# Altium schematic sheet Controller.SchDoc: Title
size A3; Date: not used; ApprovedBy: not used; CheckedBy: not used; Author: not used; CompanyName: not used; DrawnBy: Drawn by; Engineer: not used; Organization: SMS-Lab; Address1: not used; Address2: not used; Address3: not used; Address4: not used; DocumentNumber: SMS-yyyy.m; Revision: 0; Time: not used; ModifiedDate: not used; ImagePath: not used
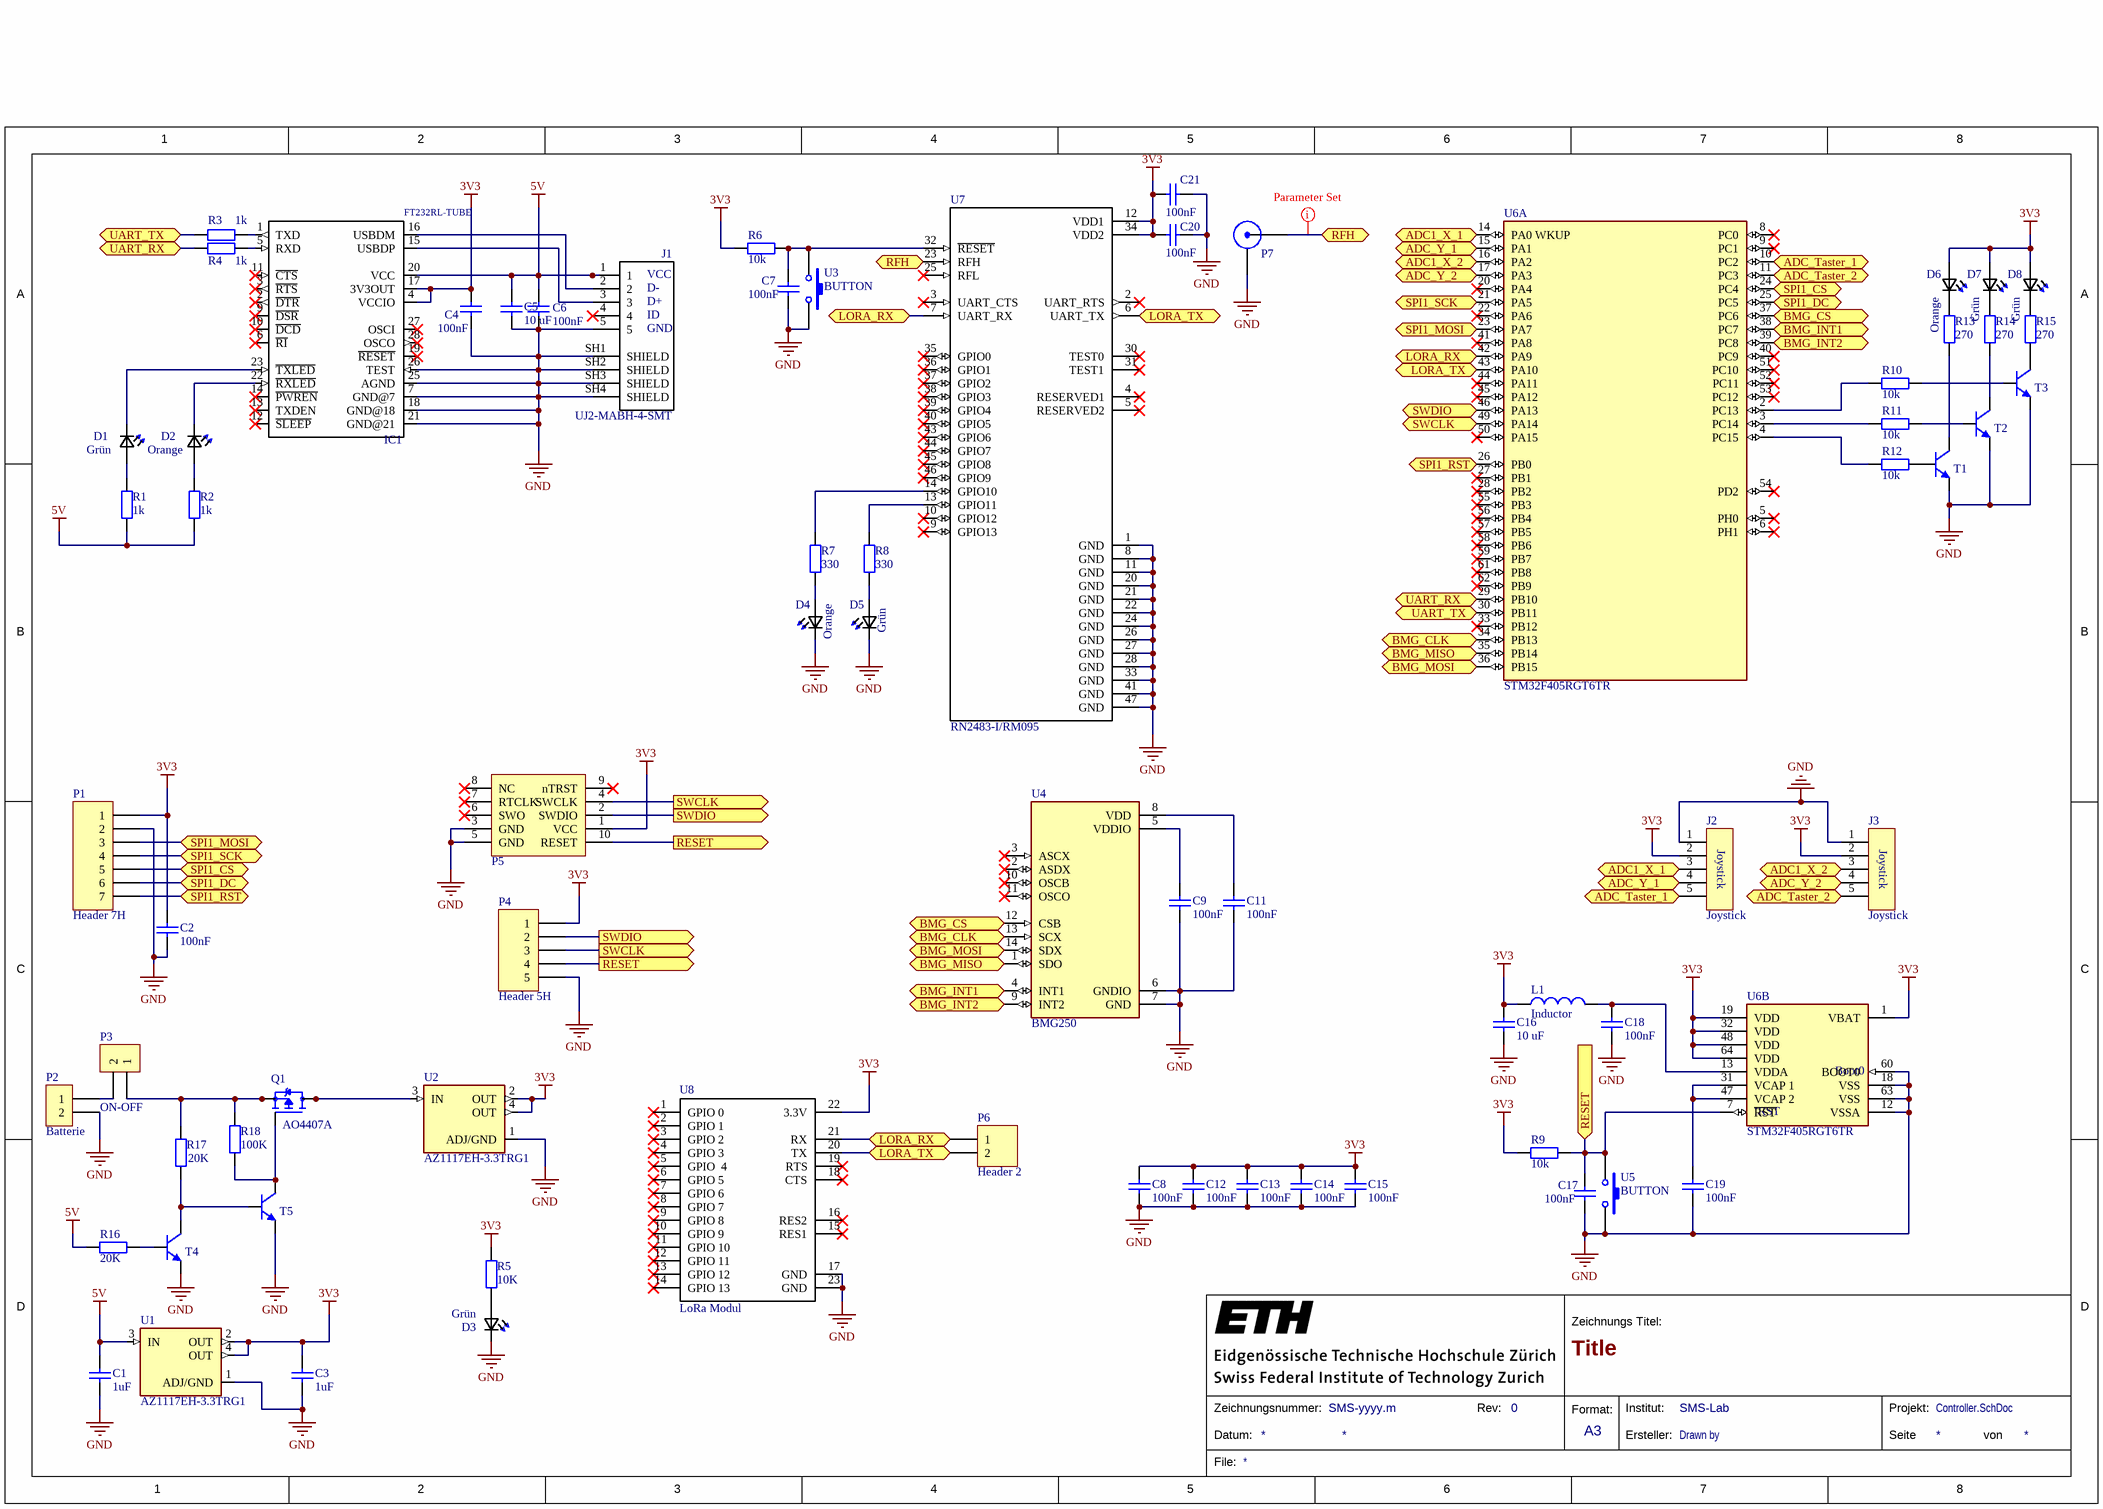
[diagram p0: Controller.SchDoc]

## Parts
C1  1uF  [CAP_0603i_1608m -N]
C2  100nF  [CAP_0402i_1005m -N]
C3  1uF  [CAP_0603i_1608m -N]
C4  100nF  [CAP_0402i_1005m -N]
C5  10 uF  [CAP_0603i_1608m -N]
C6  100nF  [CAP_0402i_1005m -N]
C7  100nF  [CAP_0402i_1005m -N]
C8  100nF  [CAP_0402i_1005m -N]
C9  100nF  [CAP_0402i_1005m -N]
C11  100nF  [CAP_0402i_1005m -N]
C12  100nF  [CAP_0402i_1005m -N]
C13  100nF  [CAP_0402i_1005m -N]
C14  100nF  [CAP_0402i_1005m -N]
C15  100nF  [CAP_0402i_1005m -N]
C16  10 uF  [CAP_0603i_1608m -N]
C17  100nF  [CAP_0402i_1005m -N]
C18  100nF  [CAP_0402i_1005m -N]
C19  100nF  [CAP_0402i_1005m -N]
C20  100nF  [CAP_0402i_1005m -N]
C21  100nF  [CAP_0402i_1005m -N]
D1  Grün  [*0603]
D2  Orange  [*0603]
D3  Grün  [*0603]
D4  Orange  [*0603]
D5  Grün  [*0603]
D6  Orange  [*0603]
D7  Grün  [*0603]
D8  Grün  [*0603]
IC1  FT232RL-TUBE  [*SSOP28-LD]  (value not drawn)
J1  UJ2-MABH-4-SMT  [*CUI_UJ2-MABH-4-SMT_UJ2-MABH-4-SMT(Primary)]
J2  Joystick  [Joystick]
J3  Joystick  [Joystick]
L1  Inductor  [IND_0805I_2013-L]
P1  Header 7H  [HDR1X7H]
P2  Batterie  [MotConnector]
P3  ON-OFF  [MotConnector]
P4  Header 5H  [HDR1X5H]
P5  Tag-Connect TC2050-IDC-NL-No pin assigned  [TAG-CONNECT TC2050-IDC-NL 10-Pin]  (value not drawn)
P6  Header 2  [HDR1X2]
P7  Hirose U.FL-R-SMT-1(10)  [Hirsoe U.FL-R-SMT-1(10)]  (value not drawn)
Q1  AO4407A  [SOIC127P600X175-8N]
R1  1k  [RES_0402i_1005m -N]
R2  1k  [RES_0402i_1005m -N]
R3  1k  [RES_0402i_1005m -N]
R4  1k  [RES_0402i_1005m -N]
R5  10K  [RES_0402i_1005m -N]
R6  10k  [RES_0402i_1005m -N]
R7  330  [RES_0402i_1005m -N]
R8  330  [RES_0402i_1005m -N]
R9  10k  [RES_0402i_1005m -N]
R10  10k  [RES_0402i_1005m -N]
R11  10k  [RES_0402i_1005m -N]
R12  10k  [RES_0402i_1005m -N]
R13  270  [RES_0603i_1608m -N]
R14  270  [RES_0603i_1608m -N]
R15  270  [RES_0603i_1608m -N]
R16  20K  [RES_0402i_1005m -N]
R17  20K  [RES_0402i_1005m -N]
R18  100K  [RES_0402i_1005m -N]
T1  Part Number: MMBT3904-7-F  [SOT-23-M]  (value not drawn)
T2  Part Number: MMBT3904-7-F  [SOT-23-M]  (value not drawn)
T3  Part Number: MMBT3904-7-F  [SOT-23-M]  (value not drawn)
T4  Part Number: MMBT3904-7-F  [SOT-23-M]  (value not drawn)
T5  Part Number: MMBT3904-7-F  [SOT-23-M]  (value not drawn)
U1  AZ1117EH-3.3TRG1  [SOT230P700X180-4N]
U2  AZ1117EH-3.3TRG1  [SOT230P700X180-4N]
U3  BUTTON  [RND 210-00206]
U4  BMG250  [XDCR_BMG250]
U5  BUTTON  [RND 210-00206]
U6  STM32F405RGT6TR  [FP-LQFP64-5W-MFG]  (parts A,B of 2)
U7  RN2483-I/RM095  [*MICROCHIP_RN2483-I/RM095]
U8  LoRa Modul  [LoRA - w/o holes]

## Ports
ADC1_X_1 (bidir), ADC1_X_2 (bidir), ADC_Taster_1 (bidir), ADC_Taster_2 (bidir), ADC_Y_1 (bidir), ADC_Y_2 (bidir), BMG_CLK (bidir), BMG_CS (bidir), BMG_INT1 (bidir), BMG_INT2 (bidir), BMG_MISO (bidir), BMG_MOSI (bidir), LORA_RX (bidir), LORA_TX (bidir), RESET (in), RESET (out), RFH (bidir), SPI1_CS (bidir), SPI1_DC (bidir), SPI1_MOSI (bidir), SPI1_RST (bidir), SPI1_SCK (bidir), SWCLK (bidir), SWCLK (out), SWDIO (bidir), SWDIO (out), UART_RX (bidir), UART_TX (bidir)

## Nets
3V3: C2.1 C3.2 C4.2 C8.2 C12.2 C13.2 C14.2 C15.2 C16.2 C20.2 C21.2 D6.2(A2) D7.2(A2) D8.2(A2) IC1.4(VCCIO) IC1.17(3V3OUT) J2.2 J3.2 L1.2 P1.1 P4.1 P5.1(VCC) R5.2 R6.1 R9.1 U1.2(OUT) U1.4(OUT) U2.2(OUT) U2.4(OUT) U6.1(VBAT) U6.19(VDD) U6.32(VDD) U6.48(VDD) U6.64(VDD) U7.12(VDD1) U7.34(VDD2) U8.22(3.3V)
5V: C1.2 C5.2 C6.2 IC1.20(VCC) J1.1 R1.1 R2.1 R16.2 U1.3(IN)
GND: C1.1 C2.2 C3.1 C4.1 C5.1 C6.1 C7.1 C8.1 C9.1 C11.1 C12.1 C13.1 C14.1 C15.1 C16.1 C17.1 C18.1 C19.2 C20.1 C21.1 D3.1(K2) D4.1(K2) D5.1(K2) IC1.7(GND@7) IC1.18(GND@18) IC1.21(GND@21) IC1.25(AGND) IC1.26(TEST) J1.5 J1.SH1(SHIELD) J1.SH2(SHIELD) J1.SH3(SHIELD) J1.SH4(SHIELD) J2.1 J3.1 P1.2 P2.2 P4.5 P5.3(GND) P5.5(GND) P7.2 T1.2(E) T2.2(E) T3.2(E) T4.2(E) T5.2(E) U1.1(ADJ/GND) U2.1(ADJ/GND) U3.1 U4.6(GNDIO) U4.7(GND) U5.1 U6.12(VSSA) U6.18(VSS) U6.60(BOOT0) U6.63(VSS) U7.1(GND) U7.8(GND) U7.11(GND) U7.20(GND) U7.21(GND) U7.22(GND) U7.24(GND) U7.26(GND) U7.27(GND) U7.28(GND) U7.33(GND) U7.41(GND) U7.47(GND) U8.17(GND) U8.23(GND)
ADC1_X_1: J2.3 U6.14(PA0_WKUP) ; port ADC1_X_1
ADC1_X_2: J3.3 U6.16(PA2) ; port ADC1_X_2
ADC_Taster_1: J2.5 U6.10(PC2) ; port ADC_Taster_1
ADC_Taster_2: J3.5 U6.11(PC3) ; port ADC_Taster_2
ADC_Y_1: J2.4 U6.15(PA1) ; port ADC_Y_1
ADC_Y_2: J3.4 U6.17(PA3) ; port ADC_Y_2
BMG_CLK: U4.13(SCX) U6.34(PB13) ; port BMG_CLK
BMG_CS: U4.12(CSB) U6.37(PC6) ; port BMG_CS
BMG_INT1: U4.4(INT1) U6.38(PC7) ; port BMG_INT1
BMG_INT2: U4.9(INT2) U6.39(PC8) ; port BMG_INT2
BMG_MISO: U4.1(SDO) U6.35(PB14) ; port BMG_MISO
BMG_MOSI: U4.14(SDX) U6.36(PB15) ; port BMG_MOSI
LORA_RX: P6.1 U6.42(PA9) U7.7(UART_RX) U8.21(RX) ; port LORA_RX
LORA_TX: P6.2 U6.43(PA10) U7.6(UART_TX) U8.20(TX) ; port LORA_TX
RESET: C17.2 P4.4 P5.10(RESET) R9.2 U5.2 U6.7(~{RST}) ; port RESET
RFH: P7.1 U7.23(RFH) ; port RFH
SPI1_CS: P1.5 U6.24(PC4) ; port SPI1_CS
SPI1_DC: P1.6 U6.25(PC5) ; port SPI1_DC
SPI1_MOSI: P1.3 U6.23(PA7) ; port SPI1_MOSI
SPI1_RST: P1.7 U6.26(PB0) ; port SPI1_RST
SPI1_SCK: P1.4 U6.21(PA5) ; port SPI1_SCK
SWCLK: P4.3 P5.4(SWCLK) U6.49(PA14) ; port SWCLK
SWDIO: P4.2 P5.2(SWDIO) U6.46(PA13) ; port SWDIO
UART_RX: R4.2 U6.29(PB10) ; port UART_RX
UART_TX: R3.2 U6.30(PB11) ; port UART_TX
NetC7_2: C7.2 R6.2 U3.2 U7.32(~{RESET})
NetC9_2: C9.2 U4.5(VDDIO)
NetC11_2: C11.2 U4.8(VDD)
NetC18_2: C18.2 L1.1 U6.13(VDDA)
NetC19_1: C19.1 U6.31(VCAP_1) U6.47(VCAP_2)
NetD1_1: D1.1(K2) IC1.23(~{TXLED})
NetD1_2: D1.2(A2) R1.2
NetD2_1: D2.1(K2) IC1.22(~{RXLED})
NetD2_2: D2.2(A2) R2.2
NetD3_2: D3.2(A2) R5.1
NetD4_2: D4.2(A2) R7.1
NetD5_2: D5.2(A2) R8.1
NetD6_1: D6.1(K2) R13.2
NetD7_1: D7.1(K2) R14.1
NetD8_1: D8.1(K2) R15.2
NetIC1_1: IC1.1(TXD) R3.1
NetIC1_5: IC1.5(RXD) R4.1
NetIC1_15: IC1.15(USBDP) J1.3
NetIC1_16: IC1.16(USBDM) J1.2
NetP2_1: P2.1 P3.2
NetP3_1: P3.1 Q1.1(S) Q1.2(S) Q1.3(S) R17.2 R18.2
NetQ1_4: Q1.4(G) R18.1 T5.3(C)
NetQ1_5: Q1.5(D) Q1.6(D) Q1.7(D) Q1.8(D) U2.3(IN)
NetR7_2: R7.2 U7.14(GPIO10)
NetR8_2: R8.2 U7.13(GPIO11)
NetR10_1: R10.1 U6.2(PC13)
NetR10_2: R10.2 T3.1(B)
NetR11_1: R11.1 U6.3(PC14)
NetR11_2: R11.2 T2.1(B)
NetR12_1: R12.1 U6.4(PC15)
NetR12_2: R12.2 T1.1(B)
NetR13_1: R13.1 T1.3(C)
NetR14_2: R14.2 T2.3(C)
NetR15_1: R15.1 T3.3(C)
NetR16_1: R16.1 T4.1(B)
NetR17_1: R17.1 T4.3(C) T5.1(B)

Not connected (* = marked no-connect by the designer): IC1 2(~{DTR})* 3(~{RTS})* 6(~{RI})* 9(~{DSR})* 10(~{DCD})* 11(~{CTS})* 12(~{SLEEP})* 13(TXDEN)* 14(~{PWREN})* 19(~{RESET})* 27(OSCI)* 28(OSCO)*; J1 4*; P5 6(SWO)* 7(RTCLK)* 8(NC)* 9(nTRST)*; U4 2(ASDX)* 3(ASCX)* 10(OSCB)* 11(OSCO)*; U6 5(PH0)* 6(PH1)* 8(PC0)* 9(PC1)* 20(PA4)* 22(PA6)* 27(PB1)* 28(PB2)* 33(PB12)* 40(PC9)* 41(PA8)* 44(PA11)* 45(PA12)* 50(PA15)* 51(PC10)* 52(PC11)* 53(PC12)* 54(PD2)* 55(PB3)* 56(PB4)* 57(PB5)* 58(PB6)* 59(PB7)* 61(PB8)* 62(PB9)*; U7 2(UART_RTS)* 3(UART_CTS)* 4(RESERVED1)* 5(RESERVED2)* 9(GPIO13)* 10(GPIO12)* 25(RFL)* 30(TEST0)* 31(TEST1)* 35(GPIO0)* 36(GPIO1)* 37(GPIO2)* 38(GPIO3)* 39(GPIO4)* 40(GPIO5)* 43(GPIO6)* 44(GPIO7)* 45(GPIO8)* 46(GPIO9)*; U8 1(GPIO_0)* 2(GPIO_1)* 3(GPIO_2)* 4(GPIO_3)* 5(GPIO__4)* 6(GPIO_5)* 7(GPIO_6)* 8(GPIO_7)* 9(GPIO_8)* 10(GPIO_9)* 11(GPIO_10)* 12(GPIO_11)* 13(GPIO_12)* 14(GPIO_13)* 15(RES1)* 16(RES2)* 18(CTS)* 19(RTS)*

## Layout directives
rule Impedance Constraint [Min = 50.00    Max = 50.00    ]: RFH

## Notes on the sheet
- (near J1) VCC
- (near J1) D-
- (near J1) D+
- (near J1) ID
- (near J1) GND
- (near U6) TX
- (near U6) RX
- (near U6) !RST
- (near U6) Boot0
- 1
- 2
- 3
- 4
- 5
- 6
- 7
- 8
- A
- B
- C
- D
- Zeichnungs Titel:
- Datum:
- Zeichnungsnummer:
- Rev:
- Format:
- A3
- Ersteller:
- Institut:
- Seite
- Projekt:
- von
- File:

## Library data of the parts
C1-C9 C11-C21 = Cap: capacitor
D1 D3 D5-D8 = LTST-C191KGKT: / LED; SMD; 0603; grün; 35mcd; 1.6x0.8x0.55mm; 130Â°; 2Ã·2.V; 20mA /; MF: Lite-On Inc.; Digi-Key_Purchase_URL: https://www.digikey.ch/product-detail/de/lite-on-inc/LTST-C191KGKT/160-1446-1-ND/386834; SnapEDA_Link: https://www.snapeda.com/parts/LTST-C191KFKT/Lite-On%20Inc./view-part/?ref=snap; MP: LTST-C191KGKT; Digi-Key_Part_Number: 160-1446-1-ND; Package: 0603 Lite-On; Value: *
D2 D4 = LTST-C191KFKT: / LED; SMD; 0603; orange; 45-90mcd; 1.6x0.8x0.55mm; 130Â°; 2Ã·2.4V; 20mA /; MF: Lite-On Inc.; Digi-Key_Purchase_URL: https://www.digikey.com/product-detail/en/lite-on-inc/LTST-C191KFKT/160-1445-1-ND/386832?utm_source=snapeda&utm_medium=aggregator&utm_campaign=symbol; SnapEDA_Link: https://www.snapeda.com/parts/LTST-C191KFKT/Lite-On%20Inc./view-part/?ref=snap; MP: LTST-C191KFKT; Digi-Key_Part_Number: 160-1445-1-ND; Package: 0603 Lite-On; Value: *
IC1 = FT232RL-TUBE: USB-to-UART 1-CH 256byte FIFO 5V 28-Pin SSOP Tube; MF: FTDI,; Digi-Key_Part_Number: 768-1306-ND; Package: SSOP-28 FTDI; Digi-Key_Purchase_URL: https://www.digikey.com/product-detail/en/ftdi-future-technology-devices-international-ltd/FT232RL-TUBE/768-1306-ND/4006920?utm_source=snapeda&utm_medium=aggregator&utm_campaign=symbol; SnapEDA_Link: https://www.snapeda.com/parts/FT232RL-TUBE/FTDI%2C%20Future%20Technology%20Devices%20International%20Ltd/view-part/?ref=snap; MP: FT232RL-TUBE; Value: *
J1 = UJ2-MABH-4-SMT: Mini AB, USB 2.0, 1 A, Right Angle, Surface Mount _SMT_, USB Receptacle; MF: CUI Inc.; Digi-Key_Part_Number: 102-5890-1-ND; Package: None; Digi-Key_Purchase_URL: https://www.digikey.com/product-detail/en/cui-inc/UJ2-MABH-4-SMT-TR/102-5890-1-ND/9838992?utm_source=snapeda&utm_medium=aggregator&utm_campaign=symbol; CUI_purchase_URL: https://www.cui.com/product/interconnect/connectors/usb-connectors/uj2-mabh-smt-series?utm_source=snapeda.com&utm_medium=referral&utm_campaign=snapedaBOM; SnapEDA_Link: https://www.snapeda.com/parts/UJ2-MABH-4-SMT/CUI%20Inc./view-part/?ref=snap; MP: UJ2-MABH-4-SMT; Value: *
P1 = Header 7H: Header, 7-Pin, Right Angle
P2 P3 = Pad, double: Single Pad or Testpoint
P4 = Header 5H: Header, 5-Pin, Right Angle
P5 = Tag-Connect TC2050-IDC-NL-No pin assigned: 10-pin pogo pin programing port
P6 = Header 2: Header, 2-Pin
P7 = Hirose U.FL-R-SMT-1(10): U.FL
Q1 = AO4407A: Mosfet p-Ch -30v -12a 8-Soic - Ao4407a; MF: {'manufacturer': u'Alpha '}; Availability: Unavailable; MP: AO4407A; Value: *; Price: None; Package: None
R1-R18 = Res: Resistor
T1-T5 = MMBT3904-7-F: Transistor SMD; Vendor: Diodes Inc; Built_By: EMA_UL_Team; Type: DEV; Manufacturer_Part_Number: MMBT3904-7-F; Copyright: Copyright (C) 2018 Accelerated Designs. All rights reserved; RefDes: RefDes; Value: Value
U1 U2 = AZ1117EH-3.3TRG1: Linear Voltage Regulator IC 1 Output 1A SOT-223; MF: Diodes Inc.; Package: SOT-223 Diodes Inc.; Value: *; Price: None; MP: AZ1117EH-3.3TRG1; SnapEDA_Link: https://www.snapeda.com/parts/AZ1117EH-3.3TRG1/Diodes%20Inc./view-part/482930/?ref=snap; Availability: Unavailable
U4 = BMG250: BMG250 Series 3.6 V 3200 Hz 850 ÂµA Low Noise Low Power Triaxial Gyroscope-LGA-14; MF: {'manufacturer': u'Bosch'}; MP: BMG250; Package: None; Price: None; Value: *; Availability: Unavailable
U6 = CMP-0243-00156-2: IC MCU 32BIT 1MB FLASH 64LQFP; Frequency: 168MHz; Number of SPI Channels: 3; Oscillator Type: Internal; Core Architecture: ARM; Number of UART Channels: 2; Max Supply Voltage: 3.6V; Watchdog Timer: Yes; RAM Size: 196KB; Interface: I2C; Max Power Dissipation: 435mW; Number of Timers/Counters: 14; Data Bus Width: 32b; Peripherals: Brown-out Detect/Reset; Number of ADC Channels: 16; Min Supply Voltage: 1.8V; Number of Programmable I/O: 51; Memory Size: 1024KB; Max Operating Temperature: 85°C; Package Quantity: 1000; Lead Free: Lead Free; Memory Type: FLASH; Case/Package: LQFP; Number of I2C Channels: 3; Contact Plating: Tin; Mount: Surface Mount; Min Operating Temperature: -40°C; Radiation Hardening: No; Number of USB Channels: 2; Packaging: Tape and Reel; Height: 1.45mm; Number of Pins: 64; Number of I/Os: 51; Max Frequency: 168MHz; Width: 10mm; Length: 10mm
U7 = RN2483-I/RM095: Sub-GHz Dual Band Long Range Transceiver LoRa Module; MF: Microchip; Availability: Unavailable; Package: None; SnapEDA_Link: https://www.snapeda.com/parts/RN2483-I/RM095/Microchip/view-part/?ref=snap; MP: RN2483-I/RM095; Price: None; Value: *